# EAGLE schematic GS_CCM_R11 (EAGLE 7.4.0)
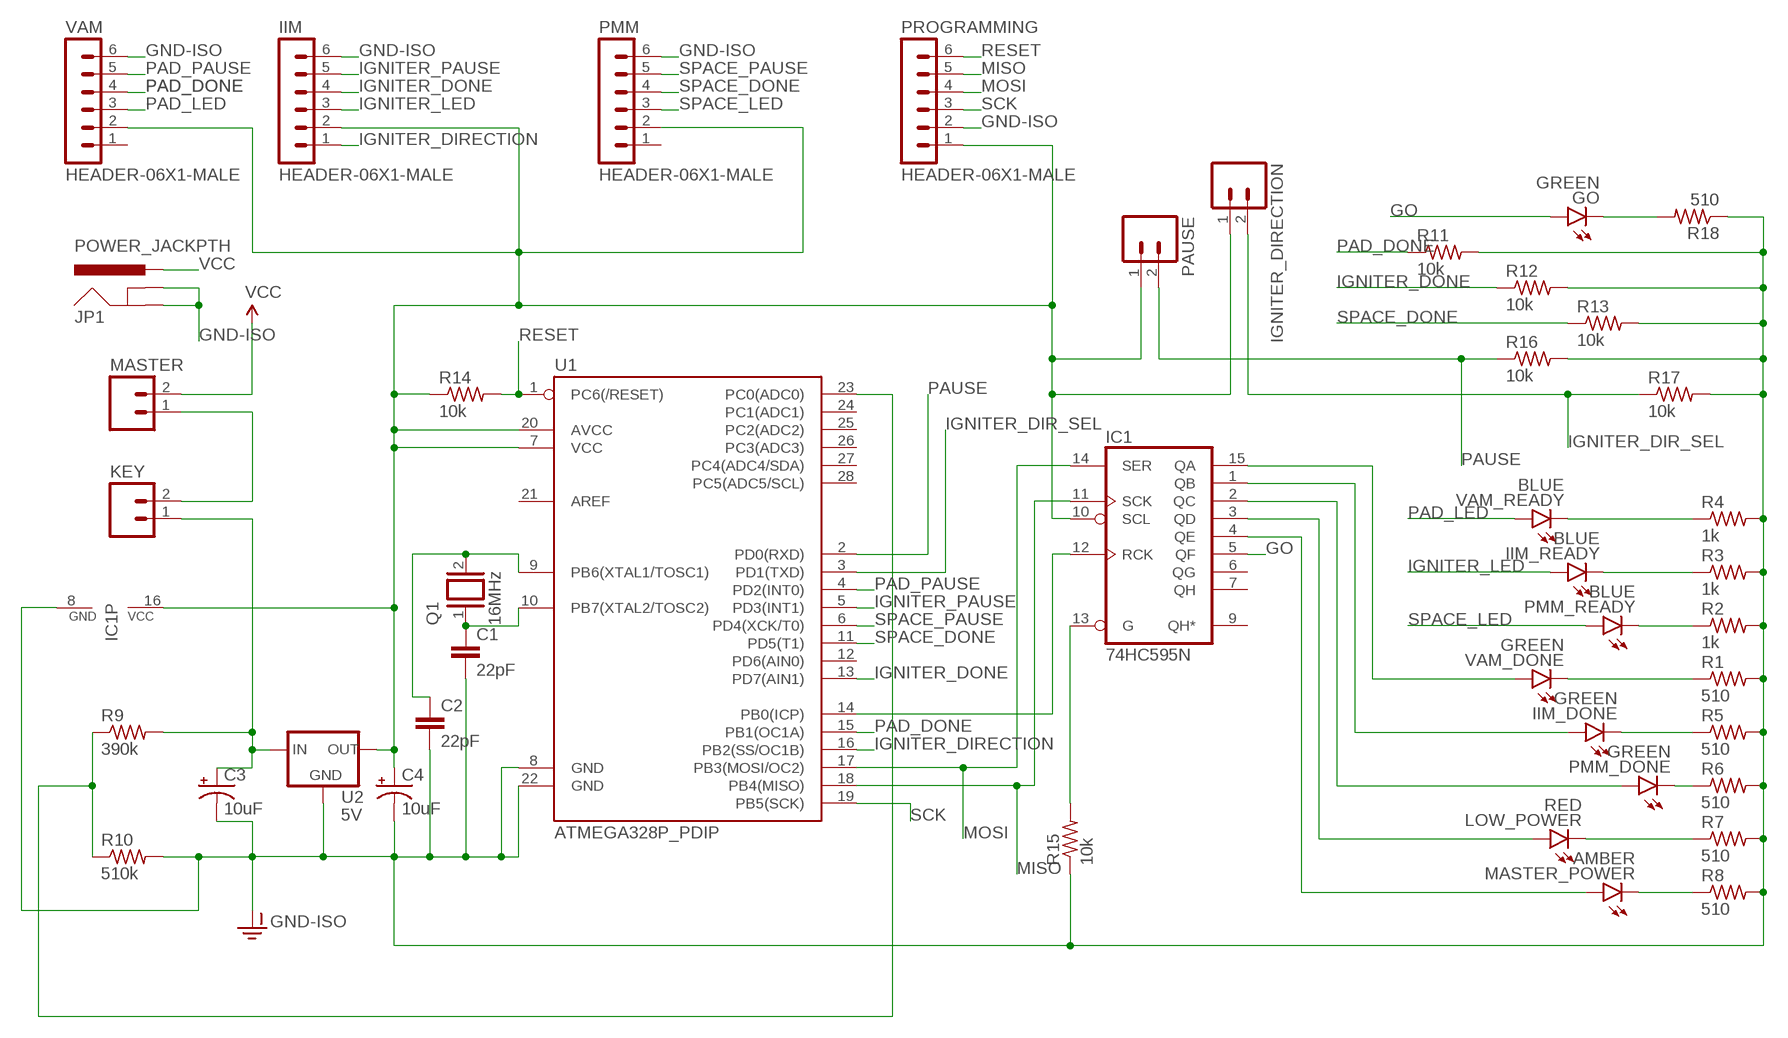
[diagram p0: schematic, sheet 1]

## Parts
C1  22pF  CAPPTH1  [CAP-PTH-5MM]
C2  22pF  CAPPTH1  [CAP-PTH-5MM]
C3  10uF  CAP_POLPTH2  [CPOL-RADIAL-10UF-25V]
C4  10uF  CAP_POLPTH2  [CPOL-RADIAL-10UF-25V]
GO  GREEN  LED5MM  [LED5MM]
IC1  74HC595N  [DIL16]
IGNITER_DIRECTION  M02LOCK  [1X02_LOCK]
IIM  HEADER-06X1-MALE  [06X1-PTH]
IIM_DONE  GREEN  LED5MM  [LED5MM]
IIM_READY  BLUE  LED5MM  [LED5MM]
JP1  POWER_JACKPTH  [POWER_JACK_PTH]
KEY  M02LOCK  [1X02_LOCK]
LOW_POWER  RED  LED5MM  [LED5MM]
MASTER  M02LOCK  [1X02_LOCK]
MASTER_POWER  AMBER  LED5MM  [LED5MM]
PAUSE  M02LOCK  [1X02_LOCK]
PMM  HEADER-06X1-MALE  [06X1-PTH]
PMM_DONE  GREEN  LED5MM  [LED5MM]
PMM_READY  BLUE  LED5MM  [LED5MM]
PROGRAMMING  HEADER-06X1-MALE  [06X1-PTH]
Q1  16MHz  XTAL/S  [QS]
R1  510  R-US_R1206  [R1206]
R2  1k  R-US_R1206  [R1206]
R3  1k  R-US_R1206  [R1206]
R4  1k  R-US_R1206  [R1206]
R5  510  R-US_R1206  [R1206]
R6  510  R-US_R1206  [R1206]
R7  510  R-US_R1206  [R1206]
R8  510  R-US_R1206  [R1206]
R9  390k  R-US_R1206  [R1206]
R10  510k  R-US_R1206  [R1206]
R11  10k  R-US_R1206  [R1206]
R12  10k  R-US_R1206  [R1206]
R13  10k  R-US_R1206  [R1206]
R14  10k  R-US_R1206  [R1206]
R15  10k  R-US_R1206  [R1206]
R16  10k  R-US_R1206  [R1206]
R17  10k  R-US_R1206  [R1206]
R18  510  R-US_R1206  [R1206]
U1  ATMEGA328P_PDIP  [DIL28-3]
U2  5V  78XXS  [78XXS]
VAM  HEADER-06X1-MALE  [06X1-PTH]
VAM_DONE  GREEN  LED5MM  [LED5MM]
VAM_READY  BLUE  LED5MM  [LED5MM]

## Nets
5V: C4.1(+) IC1.10(SCL) IC1.16(VCC) IGNITER_DIRECTION.1 IIM.2 PAUSE.1 PMM.2 PROGRAMMING.1 R14.1 U1.7(VCC) U1.20(AVCC) U2.OUT VAM.2
9V: C3.1(+) KEY.1 R9.2 U2.IN
GND-ISO: C1.2 C2.2 C3.2(-) C4.2(-) IC1.8(GND) IIM.6 JP1.GND JP1.GNDBREAK PMM.6 PROGRAMMING.2 R1.2 R2.2 R3.2 R4.2 R5.2 R6.2 R7.2 R8.2 R10.2 R11.2 R12.2 R13.2 R15.1 R16.2 R17.2 R18.1 U1.8(GND) U1.22(GND) U2.GND VAM.6
GO: GO.A IC1.5(QF)
IGNITER_DIR_SEL: IGNITER_DIRECTION.2 R17.1 U1.3(PD1(TXD))
IGNITER_DIRECTION: IIM.1 U1.16(PB2(SS/OC1B))
IGNITER_DONE: IIM.4 R12.1 U1.13(PD7(AIN1))
IGNITER_LED: IIM.3 IIM_READY.A
IGNITER_PAUSE: IIM.5 U1.5(PD3(INT1))
MISO: IC1.11(SCK) PROGRAMMING.5 U1.18(PB4(MISO))
MOSI: IC1.14(SER) PROGRAMMING.4 U1.17(PB3(MOSI/OC2))
N$3: GO.K(C) R18.2
N$4: C1.1 Q1.1 U1.10(PB7(XTAL2/TOSC2))
N$5: C2.1 Q1.2 U1.9(PB6(XTAL1/TOSC1))
N$6: KEY.2 MASTER.1
N$8: R1.1 VAM_DONE.K(C)
N$9: R9.1 R10.1 U1.23(PC0(ADC0))
N$10: PMM_READY.K(C) R2.1
N$11: IIM_READY.K(C) R3.1
N$12: R4.1 VAM_READY.K(C)
N$13: IIM_DONE.K(C) R5.1
N$14: PMM_DONE.K(C) R6.1
N$15: LOW_POWER.K(C) R7.1
N$16: MASTER_POWER.K(C) R8.1
N$18: IC1.12(RCK) U1.14(PB0(ICP))
N$20: IC1.15(QA) VAM_DONE.A
N$21: IC1.1(QB) IIM_DONE.A
N$24: IC1.2(QC) PMM_DONE.A
N$25: IC1.3(QD) LOW_POWER.A
N$26: IC1.4(QE) MASTER_POWER.A
PAD_DONE: R11.1 U1.15(PB1(OC1A)) VAM.4
PAD_LED: VAM.3 VAM_READY.A
PAD_PAUSE: U1.4(PD2(INT0)) VAM.5
PAUSE: PAUSE.2 R16.1 U1.2(PD0(RXD))
RESET: PROGRAMMING.6 R14.2 U1.1(PC6(/RESET))
SCK: PROGRAMMING.3 U1.19(PB5(SCK))
SHIFT_ENABLE: IC1.13(G) R15.2
SPACE_DONE: PMM.4 R13.1 U1.11(PD5(T1))
SPACE_LED: PMM.3 PMM_READY.A
SPACE_PAUSE: PMM.5 U1.6(PD4(XCK/T0))
VCC: JP1.PWR MASTER.2
Unconnected: IC1.6(QG) IC1.7(QH) IC1.9(QH*) PMM.1 U1.12(PD6(AIN0)) U1.21(AREF) U1.24(PC1(ADC1)) U1.25(PC2(ADC2)) U1.26(PC3(ADC3)) U1.27(PC4(ADC4/SDA)) U1.28(PC5(ADC5/SCL)) VAM.1

## Library data of the parts
C1 C2 = SparkFun-Capacitors:CAP: Capacitor Standard 0603 ceramic capacitor, and 0.1" leaded capacitor.
C3 C4 = SparkFun-Capacitors:CAP_POL: Capacitor Polarized These are standard SMD and PTH capacitors. Normally 10uF, 47uF, and 100uF in electrolytic and tantalum varieties. Always verify the external diameter of the through hole cap, it varies with capacity, voltage, and manufacturer. The EIA devices should be standard.
GO IIM_DONE IIM_READY LOW_POWER MASTER_POWER PMM_DONE PMM_READY VAM_DONE VAM_READY = SparkFun-LED:LED: LEDs Standard schematic elements and footprints for 5mm, 3mm, 1206, and 0603 sized LEDs. 5mm - Spark Fun Electronics SKU : COM-00529 (and others)
IC1 = 74xx-eu:74*595: 8-bit SHIFT REGISTER, output latch
IGNITER_DIRECTION KEY MASTER PAUSE = SparkFun-Connectors:M02: Standard 2-pin 0.1" header. Use with - straight break away headers ( PRT-00116) - right angle break away headers (PRT-00553) - swiss pins (PRT-00743) - machine pins (PRT-00117) - female headers (PRT-00115) Molex polarized connector foot print use with: PRT-08233 with associated crimp pins and housings. 2.54_SCREWTERM for use with PRT-10571. 3.5mm Screw Terminal footprints for PRT-08084 5mm Screw Terminal footprints for use with PRT-08432
IIM PMM PROGRAMMING VAM = GeekAmmo:HEADER-06X1?: 6 x 0.1 inch Header 40x1 0.1inch Male Breakaway header can be used. - 4UCON 00834 <http://www.4uconnector.com/online/SearchPro.asp?FormName=ProSearch&FormAction=search&s_GroupNo=&s_keyword=00834> For female part, if possible use 6 x 1 without breaking.; OTHER: 4UCON 00834; URL: http://www.4uconnector.com/online/SearchPro.asp?FormName=ProSearch&FormAction=search&s_GroupNo=&s_keyword=00834
JP1 = SparkFun-Connectors:POWER_JACK: Power Jack This is the standard 5.5mm barrel jack for power. The PTH is the most common, proven, reliable, footprint. The Slot footprint only works if the mill layer is transmitted to the PCB fab house so be warned. Mating wall wart : TOL-00298 (and others); PROD_ID: CONN-08197
Q1 = special:XTAL/S: CRYSTAL
R1-R18 = resistor:R-US_: RESISTOR, American symbol
U1 = SparkFun-DigitalIC:ATMEGA328P_PDIP: uC used in the Arduino 32kb flash, 1k EEPROM, 2k SRAM This is the through-hole version of this chip.
U2 = v-reg:78XXS: VOLTAGE REGULATOR